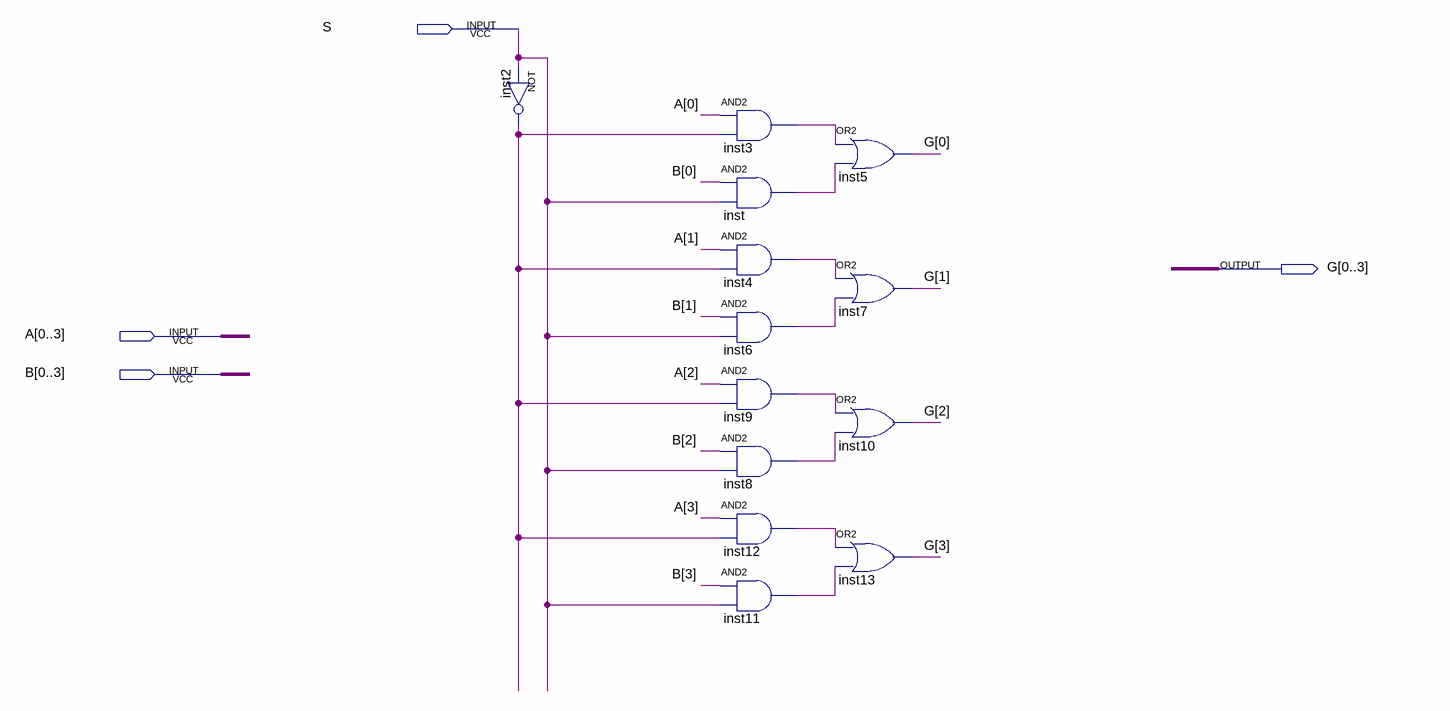
[diagram p0: schematic sheet]
// Quartus schematic 4Bit21MUX.bdf as structural Verilog: 13 symbols, 4 pins
module \4Bit21MUX  (
  input  S,
  input  [0:3] A,
  input  [0:3] B,
  output [0:3] G
);

  wire inst2_out, inst3_out, inst4_out, inst6_out, inst8_out, inst9_out, inst11_out, inst12_out, inst_out;

  not inst2 (inst2_out, S);
  and inst3 (inst3_out, A[0], inst2_out);
  and inst (inst_out, B[0], S);
  and inst4 (inst4_out, A[1], inst2_out);
  and inst6 (inst6_out, B[1], S);
  and inst9 (inst9_out, A[2], inst2_out);
  and inst8 (inst8_out, B[2], S);
  and inst12 (inst12_out, A[3], inst2_out);
  and inst11 (inst11_out, B[3], S);
  or inst5 (G[0], inst3_out, inst_out);
  or inst7 (G[1], inst4_out, inst6_out);
  or inst10 (G[2], inst9_out, inst8_out);
  or inst13 (G[3], inst12_out, inst11_out);
endmodule
